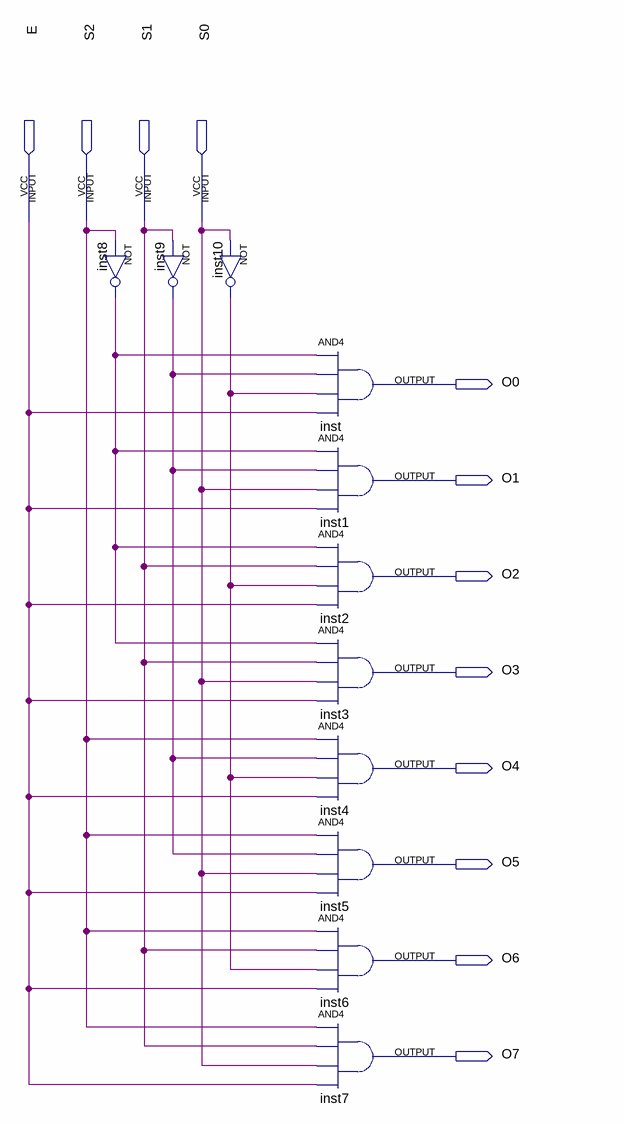
[diagram p0: schematic sheet]
// Quartus schematic Decoder_3to8bit_Design.bdf as structural Verilog: 11 symbols, 12 pins
module Decoder_3to8bit_Design (
  input  E,
  input  S2,
  input  S1,
  input  S0,
  output O0,
  output O1,
  output O2,
  output O3,
  output O4,
  output O5,
  output O6,
  output O7
);

  wire inst8_out, inst9_out, inst10_out;

  not inst8 (inst8_out, S2);
  not inst9 (inst9_out, S1);
  not inst10 (inst10_out, S0);
  and inst (O0, inst8_out, inst9_out, inst10_out, E);
  and inst1 (O1, inst8_out, inst9_out, S0, E);
  and inst2 (O2, inst8_out, S1, inst10_out, E);
  and inst3 (O3, inst8_out, S1, S0, E);
  and inst4 (O4, S2, inst9_out, inst10_out, E);
  and inst5 (O5, S2, inst9_out, S0, E);
  and inst6 (O6, S2, S1, inst10_out, E);
  and inst7 (O7, S2, S1, S0, E);
endmodule
